# EasyEDA Pro project 电子挂牌.eprj, schematic 成品
Board Name: 成品; Create Date: 2025-01-12; Page Name: P1; Project Name: 电子挂牌; Schematic Name: 成品; Update Date: 2025-01-25; Company: 嘉立创EDA; Page Size: A4; Version: V1.0
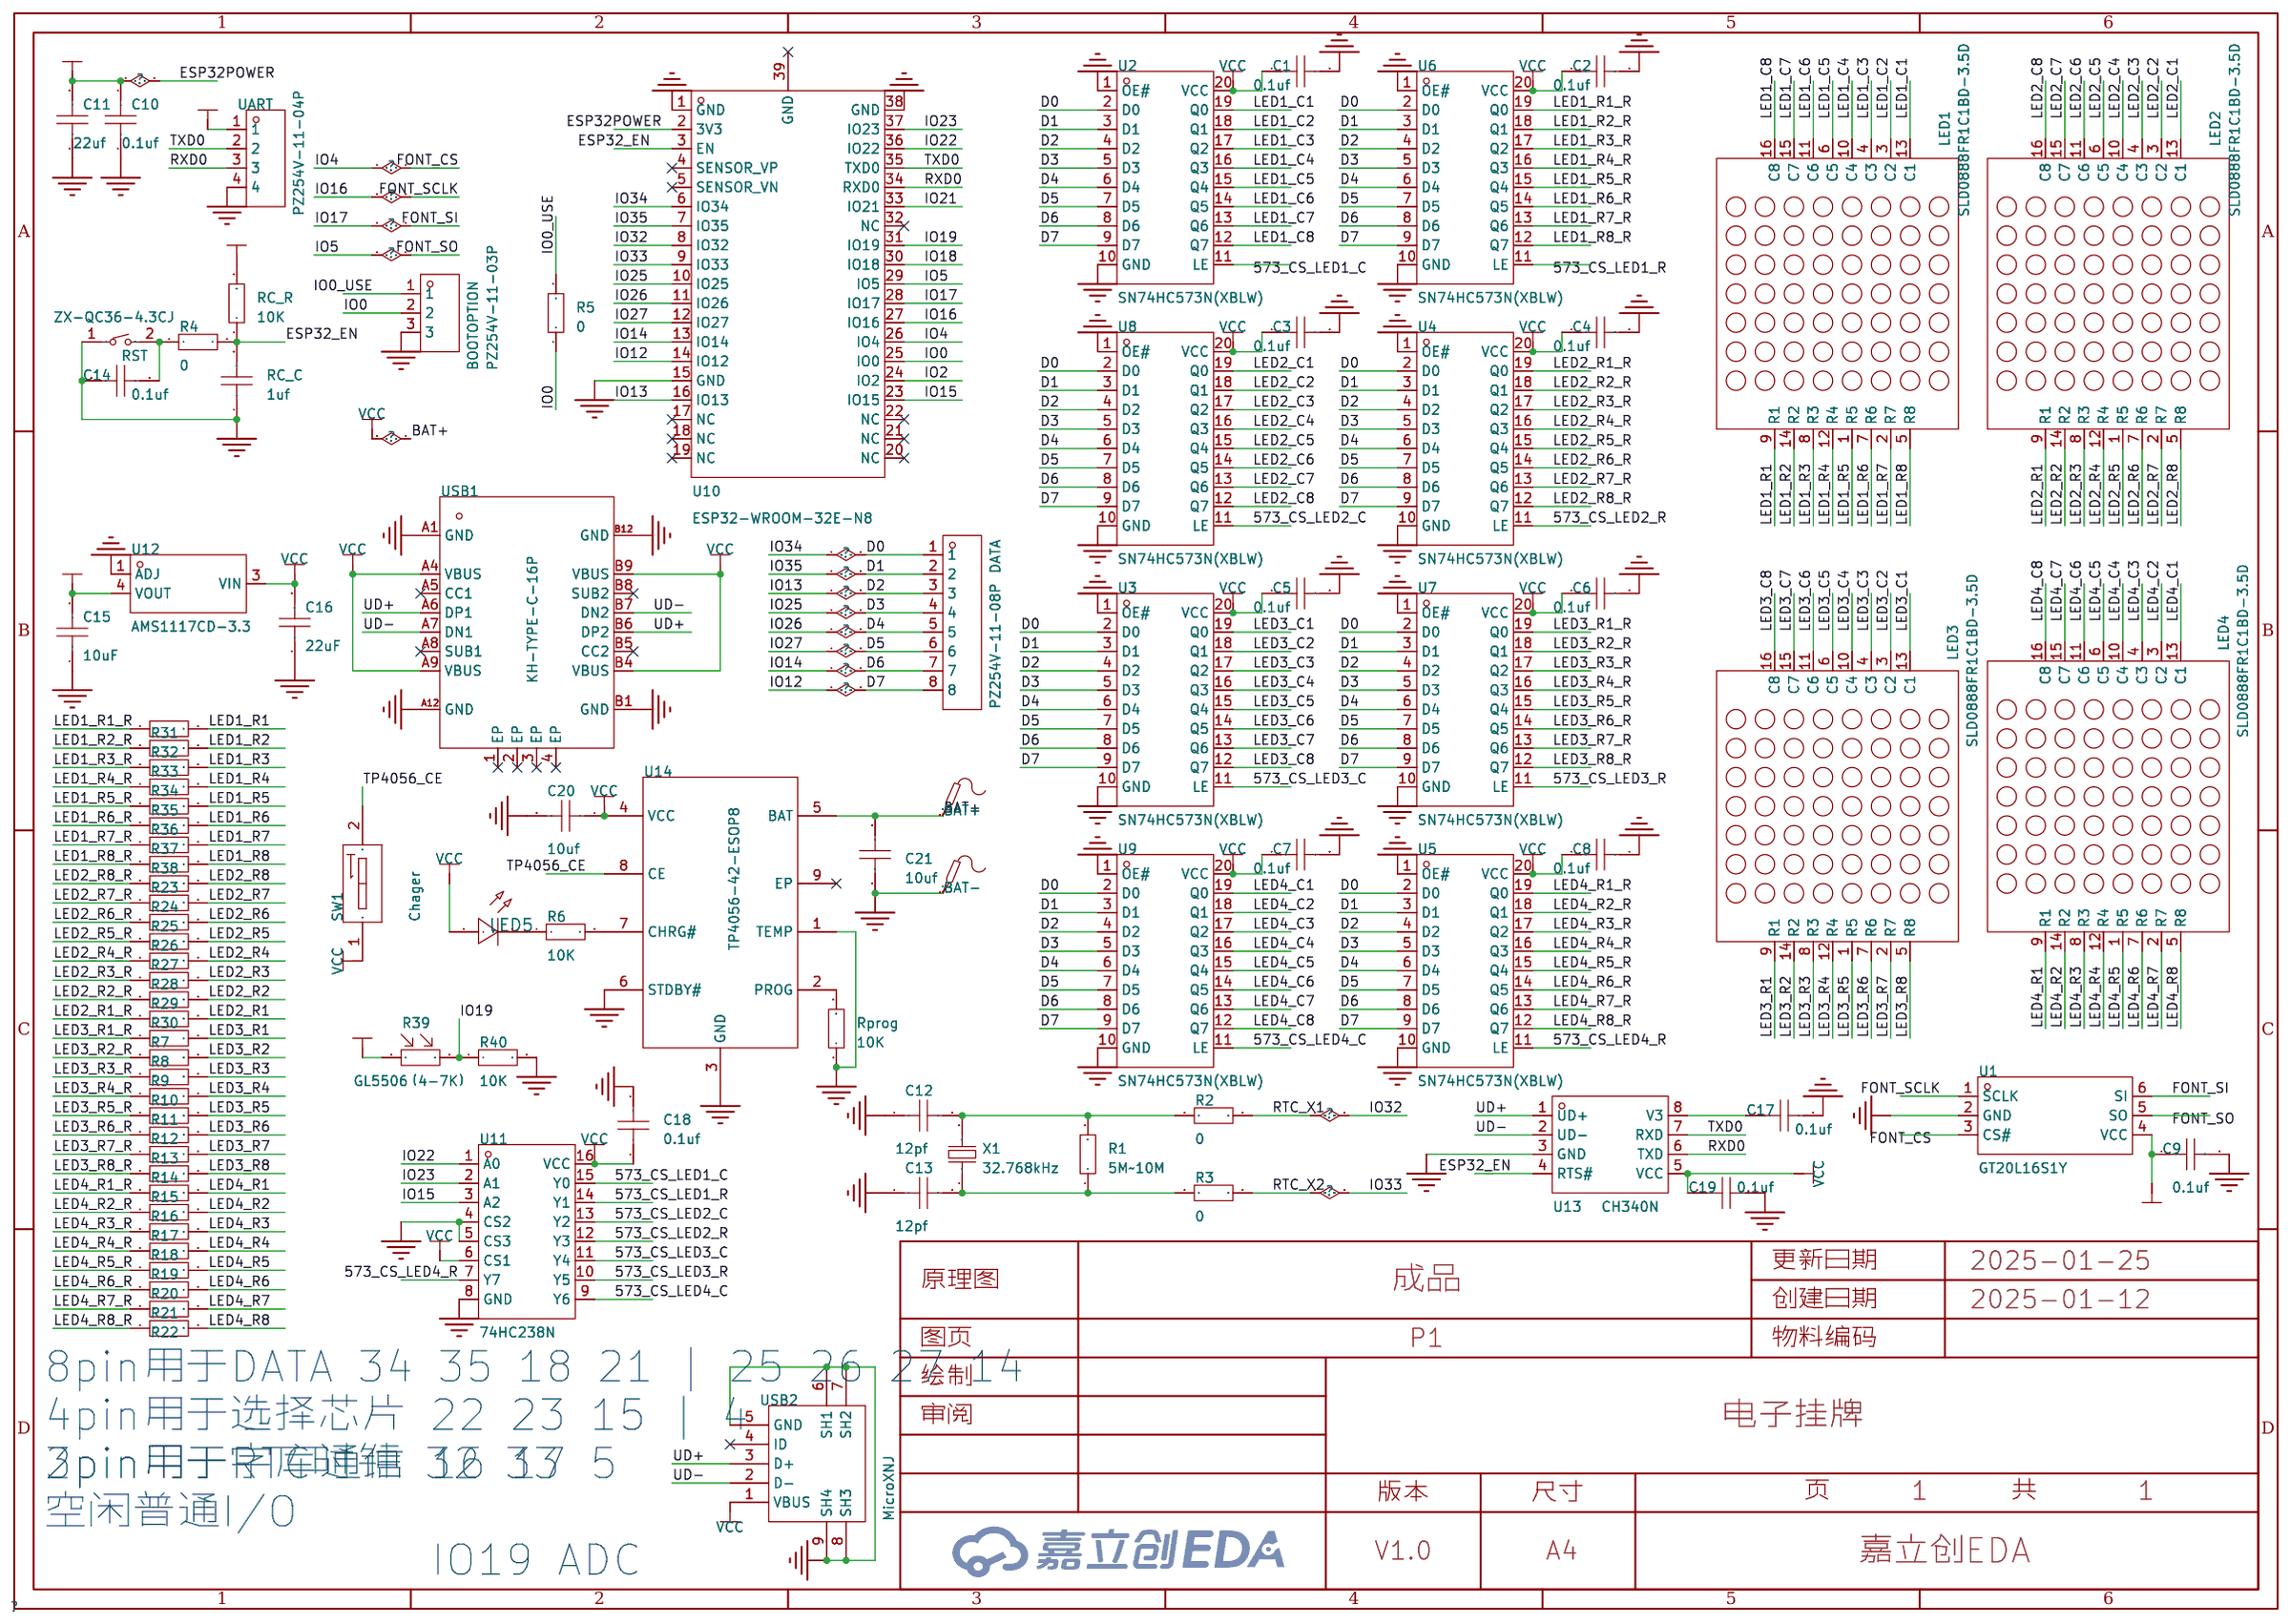
[diagram p0: schematic sheet]

## Parts
BAT+  -  [Test-Point-0.5mm]
BAT-  -  [Test-Point-0.5mm]
BOOTOPTION  PZ254V-11-03P  [HDR-TH_3P-P2.54-V-M]
C1  0.1uf  [C0805]
C2  0.1uf  [C0805]
C3  0.1uf  [C0805]
C4  0.1uf  [C0805]
C5  0.1uf  [C0805]
C6  0.1uf  [C0805]
C7  0.1uf  [C0805]
C8  0.1uf  [C0805]
C9  0.1uf  [C0805]
C10  0.1uf  [C0805]
C11  22uf  [C0805]
C12  12pf  [C0805]
C13  12pf  [C0805]
C14  0.1uf  [C0805]
C15  10uF  [CAP-SMD_L2.1-W1.4-FD]
C16  22uF  [CAP-SMD_L2.0-W1.3-FD]
C17  0.1uf  [C0805]
C18  0.1uf  [C0805]
C19  0.1uf  [C0805]
C20  10uf  [C0805]
C21  10uf  [C0805]
DATA  PZ254V-11-08P  [HDR-TH_8P-P2.54-V-M]
LED1  SLD0888FR1C1BD-3.5D  [LED-MAT-TH_SLD0888FR1C1BD-3.5D]
LED2  SLD0888FR1C1BD-3.5D  [LED-MAT-TH_SLD0888FR1C1BD-3.5D]
LED3  SLD0888FR1C1BD-3.5D  [LED-MAT-TH_SLD0888FR1C1BD-3.5D]
LED4  SLD0888FR1C1BD-3.5D  [LED-MAT-TH_SLD0888FR1C1BD-3.5D]
LED5  -  [LED_0805]
R1  5M~10M  [R0805]
R2  0  [R0805]
R3  0  [R0805]
R4  0  [R0805]
R5  0  [R0805]
R6  10K  [R0805]
R7  10K  [R0805]
R8  10K  [R0805]
R9  10K  [R0805]
R10  10K  [R0805]
R11  10K  [R0805]
R12  10K  [R0805]
R13  10K  [R0805]
R14  10K  [R0805]
R15  10K  [R0805]
R16  10K  [R0805]
R17  10K  [R0805]
R18  10K  [R0805]
R19  10K  [R0805]
R20  10K  [R0805]
R21  10K  [R0805]
R22  10K  [R0805]
R23  10K  [R0805]
R24  10K  [R0805]
R25  10K  [R0805]
R26  10K  [R0805]
R27  10K  [R0805]
R28  10K  [R0805]
R29  10K  [R0805]
R30  10K  [R0805]
R31  10K  [R0805]
R32  10K  [R0805]
R33  10K  [R0805]
R34  10K  [R0805]
R35  10K  [R0805]
R36  10K  [R0805]
R37  10K  [R0805]
R38  10K  [R0805]
R39  GL5506（4-7K）  [RES-TH_L5.1-W4.3-P3.00-D0.5]
R40  10K  [R0805]
RC_C  1uf  [C0805]
RC_R  10K  [R0805]
Rprog  10K  [R0805]
RST  ZX-QC36-4.3CJ  [KEY-TH_L6.0-W3.5-P6.50]
SW1  Chager  [SW-TH_DSWB01LHGET]
U1  GT20L16S1Y  [SOT-23-6_L2.9-W1.6-P0.95-LS2.8-BR]
U2  SN74HC573N(XBLW)  [PDIP-20_L25.9-W6.6-P2.54-LS7.9-BL]
U3  SN74HC573N(XBLW)  [PDIP-20_L25.9-W6.6-P2.54-LS7.9-BL]
U4  SN74HC573N(XBLW)  [PDIP-20_L25.9-W6.6-P2.54-LS7.9-BL]
U5  SN74HC573N(XBLW)  [PDIP-20_L25.9-W6.6-P2.54-LS7.9-BL]
U6  SN74HC573N(XBLW)  [PDIP-20_L25.9-W6.6-P2.54-LS7.9-BL]
U7  SN74HC573N(XBLW)  [PDIP-20_L25.9-W6.6-P2.54-LS7.9-BL]
U8  SN74HC573N(XBLW)  [PDIP-20_L25.9-W6.6-P2.54-LS7.9-BL]
U9  SN74HC573N(XBLW)  [PDIP-20_L25.9-W6.6-P2.54-LS7.9-BL]
U10  ESP32-WROOM-32E-N8  [WIFI-SMD_ESP32-WROOM-32E]
U11  74HC238N  [PDIP-16_L19.3-W6.5-P2.54-LS7.6-BL]
U12  AMS1117CD-3.3  [TO-252-2_L6.5-W6.1-P4.58-LS10.0-BR]
U13  CH340N  [SOP-8_L4.9-W3.9-P1.27-LS6.0-BL]
U14  TP4056-42-ESOP8  [ESOP-8_L4.9-W3.9-P1.27-LS6.0-BL-EP]
UART  PZ254V-11-04P  [HDR-TH_4P-P2.54-V-M]
USB1  KH-TYPE-C-16P  [USB-C-SMD_KH-TYPE-C-16P]
USB2  MicroXNJ  [MICRO-USB-SMD_MICROXNJ]
X1  32.768kHz  [FC-135R_L3.2-W1.5]

## Library data of the parts
BAT+ BAT- = Test-Point: Check: true
BOOTOPTION = PZ254V-11-03P: LCSC Part Name: 间距:2.54mm 1x3P 直插 方针; Supplier Part: C2937625; Manufacturer: XFCN(兴飞); Supplier Footprint: 插件,P=2.54mm; JLCPCB Part Class: 扩展库; Datasheet: https://atta.szlcsc.com/upload/public/pdf/source/20200309/C492402_8335C3D49C4E4C618838D59BB1D024C1.pdf; Supplier: LCSC; Pin Structure: 1x3P; Pitch: 2.54mm; Circluar Pins/Square Pins: 方针; Mounting Type: 直插; Number of Rows: 单排; Number of Pins: 3P; Current Rating (Max): 3A; Voltage Rating (Max): 250V; Length of Mating Pin: 6mm; Insulation Height: 2.5mm; Length of End Connection Pin: 3mm; Operating Temperature Range: -40℃~+105℃; Color: 黑色; Check: true
C1-C14 C17-C21 RC_C = CAP_0805: Supplier Footprint: 0805; Check: true
C15 = TAJP106M010RNJ: LCSC Part Name: 10uF ±20% 10V; Supplier Part: C1952866; Manufacturer: Kyocera AVX; Supplier Footprint: 0805; JLCPCB Part Class: Extended Part; Datasheet: https://atta.szlcsc.com/upload/public/pdf/source/20200508/C528414_E7647BF5233468AE8B10D12AED045AE0.pdf; Supplier: LCSC; Tolerance: ±20%; Voltage Rated: 10V; Equivalent Series Resistance(ESR): 6Ω; Operating Temperature: -55℃~+125℃
C16 = TLJR226M010R3800: LCSC Part Name: 22uF ±20% 10V; Supplier Part: C1954754; Manufacturer: Kyocera AVX; Supplier Footprint: 0805; JLCPCB Part Class: Extended Part; Datasheet: https://atta.szlcsc.com/upload/public/pdf/source/20210703/8B69E0E679BE21BB8A360EF7A68B4CB4.pdf; Supplier: LCSC; Tolerance: ±20%; Voltage Rated: 10V; Equivalent Series Resistance(ESR): 3.8Ω; Operating Temperature: -55℃~+125℃
DATA = PZ254V-11-08P: LCSC Part Name: 间距:2.54mm 1x8P 直插 方针; Supplier Part: C492407; Manufacturer: XFCN(兴飞); Supplier Footprint: 插件,P=2.54mm; JLCPCB Part Class: 扩展库; Datasheet: https://atta.szlcsc.com/upload/public/pdf/source/20200309/C492407_83A6FB26A2233368EDB9516968EC6149.pdf; Supplier: LCSC; Pin Structure: 1x8P; Pitch: 2.54mm; Circluar Pins/Square Pins: 方针; Mounting Type: 直插; Number of Rows: 单排; Number of Pins: 8P; Length of Mating Pin: 6mm; Insulation Height: 2.5mm; Length of End Connection Pin: 3mm; Contact Material: 黄铜; Operating Temperature Range: -40℃~+105℃; Color: 黑色; Check: true
LED1-LED4 = SLD0888FR1C1BD-3.5D: Supplier Part: C42378520; Manufacturer: SUNLIGHT(光华); Supplier Footprint: 插件; Datasheet: https://atta.szlcsc.com/upload/public/pdf/source/20241107/4A02A7A029C408F643D83C5EB25FDB61.pdf; Supplier: LCSC; Check: true
LED5 = LED_0805-R: Supplier Footprint: 0805; Check: true
R1-R38 R40 RC_R Rprog = Res_0805: Supplier Footprint: 0805; Check: true
R39 = GL5506（4-7K）: LCSC Part Name: 亮电阻:4kΩ~7kΩ 暗电阻:500kΩ; Supplier Part: C11299; Manufacturer: JCHL(晶创和立); Supplier Footprint: 插件,P=3mm; JLCPCB Part Class: 扩展库; Datasheet: https://atta.szlcsc.com/upload/public/pdf/source/20190717/C404970_9E7F09BFF291DADB79FAB6E4B0C8F85D.pdf; Supplier: LCSC; Dark Resistance: 500kΩ; Illuminated Resistance @ 10Lux: 4kΩ~7kΩ; Applied Voltage: 150V; Spectral Peak: 540nm; Check: true
RST = ZX-QC36-4.3CJ: LCSC Part Name: 3*6*4.3插件开关; Supplier Part: C7470223; Manufacturer: Megastar(兆星); Supplier Footprint: DIP; JLCPCB Part Class: 扩展库; Datasheet: https://atta.szlcsc.com/upload/public/pdf/source/20230724/E786959C53B2405F67FB2C8E5CC6989E.pdf; Supplier: LCSC; Circuit: 单刀单掷; Actuator Style: 矩形按钮; Operating Force: 2.6N; Mounting Style: 直插; Switch Length: 3mm; Switch Width: 6mm; Switch Height: 4.3mm; Strike Gundam: 不带支架; Contact Current: 50mA; Voltage Rating: 12V; Actuator/Cap Color: 白色; Pin Style: PC引脚; Mechanical Life: 10万次; Operating Temperature: -30℃~+80℃; Check: true
SW1 = DSWB01LHGET: LCSC Part Name: 红色宽体1位顶拨插件; Supplier Part: C126888; Manufacturer: YE; Supplier Footprint: 插件,9.9x4mm; JLCPCB Part Class: 扩展库; Datasheet: https://atta.szlcsc.com/upload/public/pdf/source/20240423/2AB41BE17D24959C6789B2A71E54D492.pdf; Supplier: LCSC; Type: 平拨,凸起式; Circuit: 单刀单掷; Number of Positions: 1位; Color: 红色; Check: true
U1 = GT20L16S1Y: LCSC Part Name: 标准点阵汉字库芯片; Supplier Part: C86840; Manufacturer: GENITOP(高通); Supplier Footprint: SOT-23-6; JLCPCB Part Class: 扩展库; Datasheet: https://atta.szlcsc.com/upload/public/pdf/source/20221202/0BEE94E7B7E0E777F9A0657D04C52243.pdf; Supplier: LCSC; Character Set: GB2312; Word Size: 16x16; Clock Rate: 80MHz; Operating Voltage Range: 2.7V~3.6V; Operating Current: 8mA; Standby Current: 8uA; Operating Temperature Range: -40℃~+85℃; Check: true
U2-U9 = SN74HC573N(XBLW): LCSC Part Name: SN74HC573N; Supplier Part: C18723528; Manufacturer: XBLW(芯伯乐); Supplier Footprint: DIP-20; JLCPCB Part Class: 扩展库; Datasheet: https://atta.szlcsc.com/upload/public/pdf/source/20231019/6710B238B3E35A8DC231EB27BEF67712.pdf; Supplier: LCSC; Logic Type: D型锁存器; Output Type: 三态; Supply Voltage: 2V~6V; Number of Channels: 8; Source Current: -7.8mA; Sink Current: 7.8mA; Propagation Delay: 14ns; Series: 74HC; OperatingTemperature: -40℃~+85℃; Check: true
U10 = ESP32-WROOM-32E-N8: LCSC Part Name: 通用型Wi-Fi+BT+BLE MCU模组; Supplier Part: C701342; Manufacturer: ESPRESSIF(乐鑫); Supplier Footprint: SMD,18x25.5mm; JLCPCB Part Class: 扩展库; Datasheet: https://atta.szlcsc.com/upload/public/pdf/source/20240307/DEBA00FAE5BA634F0D73085E4F214E93.pdf; Supplier: LCSC; Check: true
U11 = 74HC238N: Supplier Part: C5310756; Manufacturer: HGSEMI(华冠); Supplier Footprint: DIP-16; JLCPCB Part Class: Extended Part; Datasheet: https://atta.szlcsc.com/upload/public/pdf/source/20230411/E16B5B38583E9BF40568FDA1E1E3C51F.pdf; Supplier: LCSC
U12 = AMS1117CD-3.3: LCSC Part Name: 输出:3.3V 电流:1A 耐压:12V; Supplier Part: C347249; Manufacturer: UMW(友台半导体); Supplier Footprint: TO-252-2; JLCPCB Part Class: 扩展库; Datasheet: https://atta.szlcsc.com/upload/public/pdf/source/20241218/BAF0263FA2E44BCD8AF41AA4FA04EFAA.pdf; Supplier: LCSC; Output Type: 固定; Maximum Input Voltage: 18V; Output Voltage: 3.3V; Output Current: 1A; Power Supply Rejection Ratio (PSRR): 75dB@(120Hz); Dropout Voltage: 1.3V@(1A); standby current: 10mA; Feature: 过流保护(OCP); Operating Temperature: -40℃~+125℃@(Tj); Output Polarity: 正极; Number of Outputs: 1; Check: true
U13 = CH340N: LCSC Part Name: USB转串口芯片CH340; Supplier Part: C2977777; Manufacturer: WCH(南京沁恒); Supplier Footprint: SOP-8; JLCPCB Part Class: 扩展库; Datasheet: https://atta.szlcsc.com/upload/public/pdf/source/20240313/115CDE92081B1D6CB446704AD5D0F5F2.pdf; Supplier: LCSC; Applications Function: USB转串口; Protocol: USB 2.0; Number of Channels: 1; Supply Voltage: 3.3V；5V; Data Rate: 2Mbps; Operating Temperature: -20℃~+70℃; Check: true
U14 = TP4056-42-ESOP8: Supplier Part: C16581; Manufacturer: TOPPOWER(南京拓微); Supplier Footprint: ESOP-8; JLCPCB Part Class: 扩展库; Datasheet: https://atta.szlcsc.com/upload/public/pdf/source/20190626/C16581_611BCF5D7CF554EAE465137A8F68DB3E.pdf; Supplier: LCSC; Check: true
UART = PZ254V-11-04P: LCSC Part Name: 间距:2.54mm 1x4P 直插 方针; Supplier Part: C2691448; Manufacturer: XFCN(兴飞); Supplier Footprint: 插件,P=2.54mm; JLCPCB Part Class: 扩展库; Datasheet: https://atta.szlcsc.com/upload/public/pdf/source/20200309/C492403_F9F19131791D08044AD4F84F8E751A34.pdf; Supplier: LCSC; Pin Structure: 1x4P; Pitch: 2.54mm; Circluar Pins/Square Pins: 方针; Mounting Type: 直插; Number of Rows: 单排; Number of Pins: 4P; Current Rating (Max): 3A; Voltage Rating (Max): 250V; Length of Mating Pin: 6mm; Insulation Height: 2.5mm; Length of End Connection Pin: 3mm; Operating Temperature Range: -40℃~+105℃; Color: 黑色; Check: true
USB1 = KH-TYPE-C-16P: LCSC Part Name: Type-C 母 卧贴; Supplier Part: C709357; Manufacturer: kinghelm(金航标); Supplier Footprint: SMD; JLCPCB Part Class: 扩展库; Datasheet: https://atta.szlcsc.com/upload/public/pdf/source/20200911/C709357_AA8DCEB38BB20E3035A7ED7AE7667837.pdf; Supplier: LCSC; Connector Type: Type-C; Gender: 母; Number of Ports: 1; Number of Contacts: 16P; Mounting Style: 卧贴; Current Rating - Power (Max): 3A; Operating Temperature Range: -40℃~+85℃; Check: true
USB2 = MicroXNJ: LCSC Part Name: Micro-B 母 卧贴; Supplier Part: C404969; Manufacturer: SHOU HAN(首韩); Supplier Footprint: SMD; JLCPCB Part Class: 扩展库; Datasheet: https://atta.szlcsc.com/upload/public/pdf/source/20220415/2494EDFF499AF6F852F7C820374B6AF3.pdf; Supplier: LCSC; Connector Type: Micro-B; Standard: USB 2.0; Gender: 母; Mounting Style: 卧贴; Number of Contacts: 5P; Number of Ports: 1; Current Rating - Power (Max): 1.8A; Operating Temperature Range: -20℃~+85℃; Rated Voltage (Max): 30V; Connect-Disconnect Life: 5千次; Core Colour: 黑色; Check: true
X1 = Q13FC13500004_C32346: LCSC Part Name: 32.768kHz ±20ppm 12.5pF; Supplier Part: C32346; Manufacturer: EPSON(爱普生); Manufacturer Part: Q13FC13500004; Supplier Footprint: SMD3215-2P; JLCPCB Part Class: 基础库; Datasheet: https://atta.szlcsc.com/upload/public/pdf/source/20240418/0E0FF5F0356BA3753F616001439D1416.pdf; Supplier: LCSC; Crystal Type: 贴片晶振; Normal temperature Frequency Tolerance: ±20ppm; Load Capacitor: 12.5pF; Equivalent Series Resistance (ESR): 70kΩ; Operating Temperature: -40℃~+85℃; Check: true

## Nets
GND: BAT-.1 BOOTOPTION.3 C1.2 C2.2 C3.2 C4.2 C5.2 C6.2 C7.2 C8.2 C9.2 C10.1 C11.1 C12.1 C13.1 C14.1 C15.1 C16.1 C17.2 C18.2 C19.2 C20.2 C21.1 R40.2 RC_C.1 Rprog.1 RST.1 U1.2(GND) U2.1(OE#) U2.10(GND) U3.1(OE#) U3.10(GND) U4.1(OE#) U4.10(GND) U5.1(OE#) U5.10(GND) U6.1(OE#) U6.10(GND) U7.1(OE#) U7.10(GND) U8.1(OE#) U8.10(GND) U9.1(OE#) U9.10(GND) U10.1(GND) U10.15(GND) U10.38(GND) U11.4(CS2) U11.5(CS3) U11.8(GND) U12.1(ADJ) U13.3(GND) U14.1(TEMP) U14.3(GND) U14.6(STDBY#) UART.4 USB1.A1(GND) USB1.A12(GND) USB1.B1(GND) USB1.B12(GND) USB2.5(GND) USB2.6(SH1) USB2.7(SH2) USB2.8(SH3) USB2.9(SH4)
VCC: BAT+.1 C1.1 C2.1 C3.1 C4.1 C5.1 C6.1 C7.1 C8.1 C16.2 C18.1 C19.1 C20.1 C21.2 LED5.2(A) SW1.1(A1) U2.20(VCC) U3.20(VCC) U4.20(VCC) U5.20(VCC) U6.20(VCC) U7.20(VCC) U8.20(VCC) U9.20(VCC) U11.6(CS1) U11.16(VCC) U12.3(VIN) U13.5(VCC) U14.4(VCC) U14.5(BAT) USB1.A4(VBUS) USB1.A9(VBUS) USB1.B4(VBUS) USB1.B9(VBUS) USB2.1(VBUS)
VDD33: C9.1 C10.2 C11.2 C15.2 R39.1 RC_R.2 U1.4(VCC) U10.2(3V3) U12.4(VOUT) UART.1
573_CS_LED1_C: U2.11(LE) U11.15(Y0)
573_CS_LED1_R: U6.11(LE) U11.14(Y1)
573_CS_LED2_C: U8.11(LE) U11.13(Y2)
573_CS_LED2_R: U4.11(LE) U11.12(Y3)
573_CS_LED3_C: U3.11(LE) U11.11(Y4)
573_CS_LED3_R: U7.11(LE) U11.10(Y5)
573_CS_LED4_C: U9.11(LE) U11.9(Y6)
573_CS_LED4_R: U5.11(LE) U11.7(Y7)
D0: DATA.1 U2.2(D0) U3.2(D0) U4.2(D0) U5.2(D0) U6.2(D0) U7.2(D0) U8.2(D0) U9.2(D0) U10.6(IO34)
D1: DATA.2 U2.3(D1) U3.3(D1) U4.3(D1) U5.3(D1) U6.3(D1) U7.3(D1) U8.3(D1) U9.3(D1) U10.7(IO35)
D2: DATA.3 U2.4(D2) U3.4(D2) U4.4(D2) U5.4(D2) U6.4(D2) U7.4(D2) U8.4(D2) U9.4(D2) U10.16(IO13)
D3: DATA.4 U2.5(D3) U3.5(D3) U4.5(D3) U5.5(D3) U6.5(D3) U7.5(D3) U8.5(D3) U9.5(D3) U10.10(IO25)
D4: DATA.5 U2.6(D4) U3.6(D4) U4.6(D4) U5.6(D4) U6.6(D4) U7.6(D4) U8.6(D4) U9.6(D4) U10.11(IO26)
D5: DATA.6 U2.7(D5) U3.7(D5) U4.7(D5) U5.7(D5) U6.7(D5) U7.7(D5) U8.7(D5) U9.7(D5) U10.12(IO27)
D6: DATA.7 U2.8(D6) U3.8(D6) U4.8(D6) U5.8(D6) U6.8(D6) U7.8(D6) U8.8(D6) U9.8(D6) U10.13(IO14)
D7: DATA.8 U2.9(D7) U3.9(D7) U4.9(D7) U5.9(D7) U6.9(D7) U7.9(D7) U8.9(D7) U9.9(D7) U10.14(IO12)
ESP32_EN: R4.2 RC_C.2 RC_R.1 U10.3(EN) U13.4(RTS#)
FONT_CS: U1.3(CS#) U10.26(IO4)
FONT_SCLK: U1.1(SCLK) U10.27(IO16)
FONT_SI: U1.6(SI) U10.28(IO17)
FONT_SO: U1.5(SO) U10.29(IO5)
IO0: BOOTOPTION.2 R5.1 U10.25(IO0)
IO0_USE: BOOTOPTION.1 R5.2
IO2: U10.24(IO2)
IO15: U10.23(IO15) U11.3(A2)
IO18: U10.30(IO18)
IO19: R39.2 R40.1 U10.31(IO19)
IO21: U10.33(IO21)
IO22: U10.36(IO22) U11.1(A0)
IO23: U10.37(IO23) U11.2(A1)
IO32: R2.2 U10.8(IO32)
IO33: R3.2 U10.9(IO33)
LED1_C1: LED1.13(C1) U2.19(Q0)
LED1_C2: LED1.3(C2) U2.18(Q1)
LED1_C3: LED1.4(C3) U2.17(Q2)
LED1_C4: LED1.10(C4) U2.16(Q3)
LED1_C5: LED1.6(C5) U2.15(Q4)
LED1_C6: LED1.11(C6) U2.14(Q5)
LED1_C7: LED1.15(C7) U2.13(Q6)
LED1_C8: LED1.16(C8) U2.12(Q7)
LED1_R1: LED1.9(R1) R31.2
LED1_R1_R: R31.1 U6.19(Q0)
LED1_R2: LED1.14(R2) R32.2
LED1_R2_R: R32.1 U6.18(Q1)
LED1_R3: LED1.8(R3) R33.2
LED1_R3_R: R33.1 U6.17(Q2)
LED1_R4: LED1.12(R4) R34.2
LED1_R4_R: R34.1 U6.16(Q3)
LED1_R5: LED1.1(R5) R35.2
LED1_R5_R: R35.1 U6.15(Q4)
LED1_R6: LED1.7(R6) R36.2
LED1_R6_R: R36.1 U6.14(Q5)
LED1_R7: LED1.2(R7) R37.2
LED1_R7_R: R37.1 U6.13(Q6)
LED1_R8: LED1.5(R8) R38.2
LED1_R8_R: R38.1 U6.12(Q7)
LED2_C1: LED2.13(C1) U8.19(Q0)
LED2_C2: LED2.3(C2) U8.18(Q1)
LED2_C3: LED2.4(C3) U8.17(Q2)
LED2_C4: LED2.10(C4) U8.16(Q3)
LED2_C5: LED2.6(C5) U8.15(Q4)
LED2_C6: LED2.11(C6) U8.14(Q5)
LED2_C7: LED2.15(C7) U8.13(Q6)
LED2_C8: LED2.16(C8) U8.12(Q7)
LED2_R1: LED2.9(R1) R30.2
LED2_R1_R: R30.1 U4.19(Q0)
LED2_R2: LED2.14(R2) R29.2
LED2_R2_R: R29.1 U4.18(Q1)
LED2_R3: LED2.8(R3) R28.2
LED2_R3_R: R28.1 U4.17(Q2)
LED2_R4: LED2.12(R4) R27.2
LED2_R4_R: R27.1 U4.16(Q3)
LED2_R5: LED2.1(R5) R26.2
LED2_R5_R: R26.1 U4.15(Q4)
LED2_R6: LED2.7(R6) R25.2
LED2_R6_R: R25.1 U4.14(Q5)
LED2_R7: LED2.2(R7) R24.2
LED2_R7_R: R24.1 U4.13(Q6)
LED2_R8: LED2.5(R8) R23.2
LED2_R8_R: R23.1 U4.12(Q7)
LED3_C1: LED3.13(C1) U3.19(Q0)
LED3_C2: LED3.3(C2) U3.18(Q1)
LED3_C3: LED3.4(C3) U3.17(Q2)
LED3_C4: LED3.10(C4) U3.16(Q3)
LED3_C5: LED3.6(C5) U3.15(Q4)
LED3_C6: LED3.11(C6) U3.14(Q5)
LED3_C7: LED3.15(C7) U3.13(Q6)
LED3_C8: LED3.16(C8) U3.12(Q7)
LED3_R1: LED3.9(R1) R7.2
LED3_R1_R: R7.1 U7.19(Q0)
LED3_R2: LED3.14(R2) R8.2
LED3_R2_R: R8.1 U7.18(Q1)
LED3_R3: LED3.8(R3) R9.2
LED3_R3_R: R9.1 U7.17(Q2)
LED3_R4: LED3.12(R4) R10.2
LED3_R4_R: R10.1 U7.16(Q3)
LED3_R5: LED3.1(R5) R11.2
LED3_R5_R: R11.1 U7.15(Q4)
LED3_R6: LED3.7(R6) R12.2
LED3_R6_R: R12.1 U7.14(Q5)
LED3_R7: LED3.2(R7) R13.2
LED3_R7_R: R13.1 U7.13(Q6)
LED3_R8: LED3.5(R8) R14.2
LED3_R8_R: R14.1 U7.12(Q7)
LED4_C1: LED4.13(C1) U9.19(Q0)
LED4_C2: LED4.3(C2) U9.18(Q1)
LED4_C3: LED4.4(C3) U9.17(Q2)
LED4_C4: LED4.10(C4) U9.16(Q3)
LED4_C5: LED4.6(C5) U9.15(Q4)
LED4_C6: LED4.11(C6) U9.14(Q5)
LED4_C7: LED4.15(C7) U9.13(Q6)
LED4_C8: LED4.16(C8) U9.12(Q7)
LED4_R1: LED4.9(R1) R15.2
LED4_R1_R: R15.1 U5.19(Q0)
LED4_R2: LED4.14(R2) R16.2
LED4_R2_R: R16.1 U5.18(Q1)
LED4_R3: LED4.8(R3) R17.2
LED4_R3_R: R17.1 U5.17(Q2)
LED4_R4: LED4.12(R4) R18.2
LED4_R4_R: R18.1 U5.16(Q3)
LED4_R5: LED4.1(R5) R19.2
LED4_R5_R: R19.1 U5.15(Q4)
LED4_R6: LED4.7(R6) R20.2
LED4_R6_R: R20.1 U5.14(Q5)
LED4_R7: LED4.2(R7) R21.2
LED4_R7_R: R21.1 U5.13(Q6)
LED4_R8: LED4.5(R8) R22.2
LED4_R8_R: R22.1 U5.12(Q7)
RXD0: U10.34(RXD0) U13.6(TXD) UART.3
TP4056_CE: SW1.2 U14.8(CE)
TXD0: U10.35(TXD0) U13.7(RXD) UART.2
UD+: U13.1(UD+) USB1.A6(DP1) USB1.B6(DP2) USB2.3(D+)
UD-: U13.2(UD-) USB1.A7(DN1) USB1.B7(DN2) USB2.2(D-)
$1N5018: C14.2 R4.1 RST.2
$1N5403: C12.2 R1.2 R2.1 X1.2
$1N5415: C13.2 R1.1 R3.1 X1.1
$1N8034: C17.1 U13.8(V3)
$1N9172: R6.2 U14.7(CHRG#)
$1N9198: LED5.1(C) R6.1
$1N9310: Rprog.2 U14.2(PROG)

Not connected (* = marked no-connect by the designer): U10 4(SENSOR_VP)* 5(SENSOR_VN)* 17(NC)* 18(NC)* 19(NC)* 20(NC)* 21(NC)* 22(NC)* 32(NC)* 39(GND)*; U14 9(EP)*; USB1 1(EP)* 2(EP)* 3(EP)* 4(EP)* A5(CC1)* A8(SUB1)* B5(CC2)* B8(SUB2)*; USB2 4(ID)*

## Notes on the sheet
- 8pin用于DATA 34 35 18 21 | 25 26 27 14
- 4pin用于选择芯片 22 23 15 | 4
- 3pin用于字库通信 16 17 5
- 2pin用于RTC时钟 32 33
  空闲普通I/O
- IO19 ADC
